# EAGLE design LEDFB (EAGLE 7.5.0)

## Sheet 1 of 4: MCU
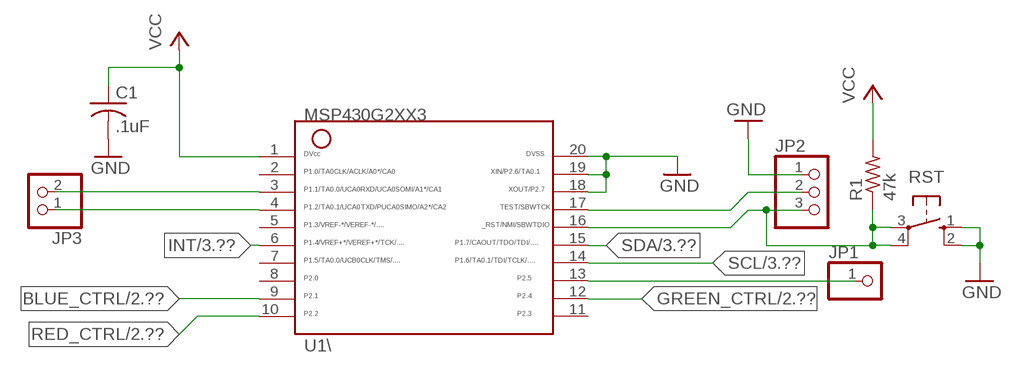
[diagram p0: schematic, sheet 1]

### Parts
C1  .1uF  C-USC0805  [C0805]
JP1  PINHD-1X1  [1X01]
JP2  PINHD-1X3  [1X03]
JP3  PINHD-1X2  [1X02]
R1  47k  R-US_R0805  [R0805]
RST  10-XX  [B3F-10XX]
U1\  G2XX3---PW20  [PW20]

### Nets
BLUE_CTRL: U1\.9 ; also sheet 2
GND: C1.2 JP2.1 RST.1(S) RST.2(S1) U1\.18 U1\.19 U1\.20 ; also sheet 2,3,4
GREEN_CTRL: U1\.12 ; also sheet 2
INT: U1\.6 ; also sheet 3
N$1: JP3.2 U1\.3
N$2: JP3.1 U1\.4
N$3: JP1.1 U1\.13
N$6: JP2.2 U1\.17
N$7: JP2.3 R1.1 RST.3(P) RST.4(P1) U1\.16
RED_CTRL: U1\.10 ; also sheet 2
SCL: U1\.14 ; also sheet 3
SDA: U1\.15 ; also sheet 3
VCC: C1.1 R1.2 U1\.1 ; also sheet 2,3,4
Unconnected: U1\.2 U1\.5 U1\.7 U1\.8 U1\.11

## Sheet 2 of 4: LED Drive
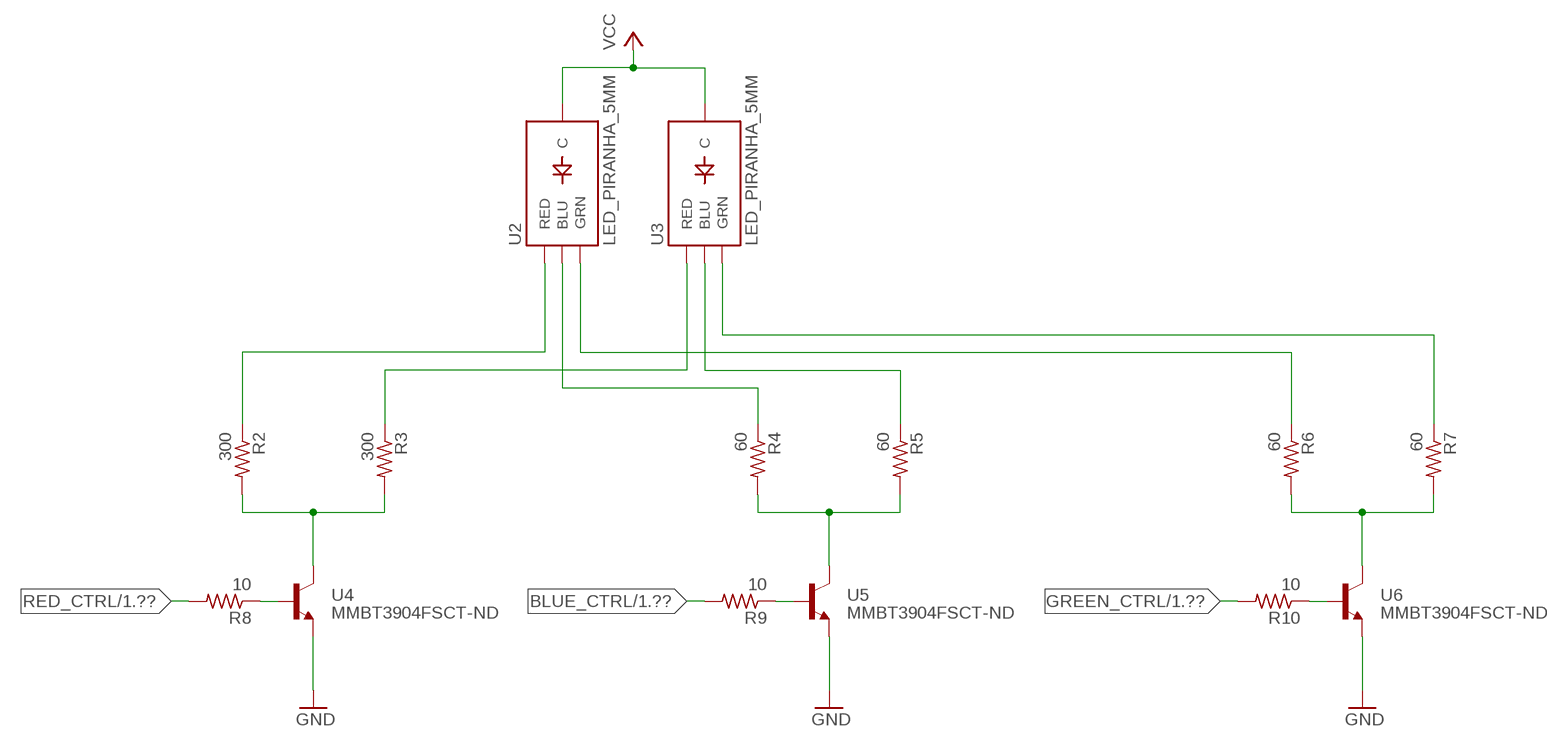
[diagram p1: schematic, sheet 2]

### Parts
R2  300  R-US_R0805  [R0805]
R3  300  R-US_R0805  [R0805]
R4  60  R-US_R0805  [R0805]
R5  60  R-US_R0805  [R0805]
R6  60  R-US_R0805  [R0805]
R7  60  R-US_R0805  [R0805]
R8  10  R-US_R0805  [R0805]
R9  10  R-US_R0805  [R0805]
R10  10  R-US_R0805  [R0805]
U2  LED_PIRANHA_5MM  [LED_PIRANHA_5MM]
U3  LED_PIRANHA_5MM  [LED_PIRANHA_5MM]
U4  MMBT3904FSCT-ND  [SOT-23]
U5  MMBT3904FSCT-ND  [SOT-23]
U6  MMBT3904FSCT-ND  [SOT-23]

### Nets
BLUE_CTRL: R9.2 ; also sheet 1
GND: U4.2(E) U5.2(E) U6.2(E) ; also sheet 1,3,4
GREEN_CTRL: R10.2 ; also sheet 1
N$4: R2.1 U2.R(RED)
N$5: R3.1 U3.R(RED)
N$8: R2.2 R3.2 U4.3(C)
N$9: R4.1 U2.B(BLU)
N$12: R8.1 U4.1(B)
N$13: R9.1 U5.1(B)
N$14: R10.1 U6.1(B)
N$15: R5.1 U3.B(BLU)
N$16: R4.2 R5.2 U5.3(C)
N$17: R6.2 R7.2 U6.3(C)
N$18: R6.1 U2.G(GRN)
N$19: R7.1 U3.G(GRN)
RED_CTRL: R8.2 ; also sheet 1
VCC: U2.C U3.C ; also sheet 1,3,4

## Sheet 3 of 4: Gyro
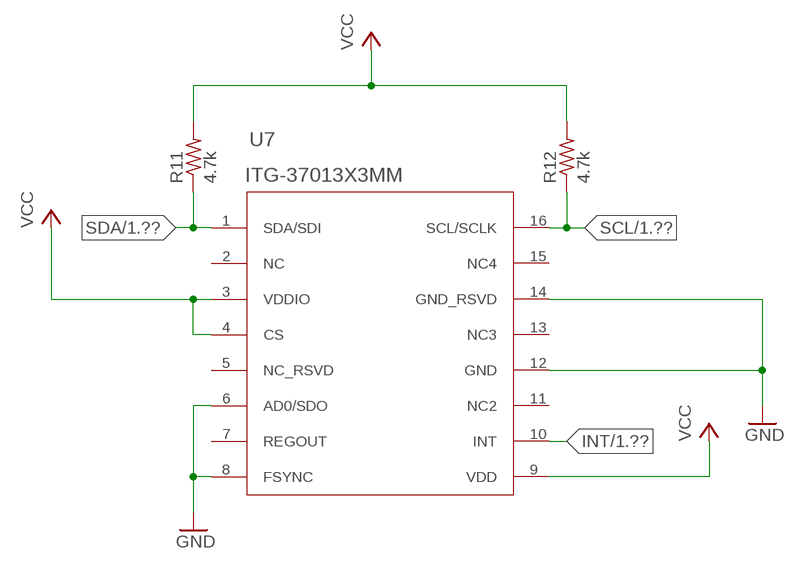
[diagram p2: schematic, sheet 3]

### Parts
R11  4.7k  R-US_M0805  [M0805]
R12  4.7k  R-US_M0805  [M0805]
U7  ITG-37013X3MM  [QFN-16]

### Nets
GND: U7.6(AD0/SDO) U7.8(FSYNC) U7.12(GND) U7.14(GND_RSVD) ; also sheet 1,2,4
INT: U7.10(INT) ; also sheet 1
SCL: R12.1 U7.16(SCL/SCLK) ; also sheet 1
SDA: R11.1 U7.1(SDA/SDI) ; also sheet 1
VCC: R11.2 R12.2 U7.3(VDDIO) U7.4(CS) U7.9(VDD) ; also sheet 1,2,4
Unconnected: U7.2(NC) U7.7(REGOUT) U7.11(NC2)

## Sheet 4 of 4: Power
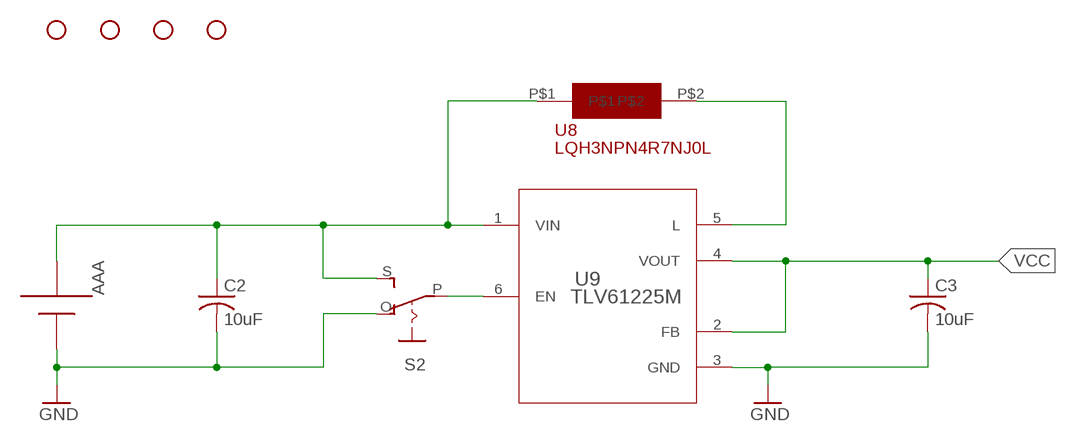
[diagram p3: schematic, sheet 4]

### Parts
AAA  AAA  [12BH412]
C2  10uF  C-USC0805  [C0805]
C3  10uF  C-USC0805  [C0805]
H1  STAND-OFF  [STAND-OFF]
H2  STAND-OFF  [STAND-OFF]
H3  STAND-OFF  [STAND-OFF]
H4  STAND-OFF  [STAND-OFF]
S2  EG1218S  [EG1218]
U8  LQH3NPN4R7NJ0  [1212]
U9  TLV61225M  [DCK0006A_M]

### Nets
GND: AAA.- C2.2 C3.2 S2.O U9.3(GND) ; also sheet 1,2,3
N$20: AAA.+ C2.1 S2.S U8.P$1 U9.1(VIN)
N$21: S2.P U9.6(EN)
N$22: U8.P$2 U9.5(L)
VCC: C3.1 U9.2(FB) U9.4(VOUT) ; also sheet 1,2,3

## Power pins joined to a net without a drawn wire
NC3: U7.13(NC3)
NC4: U7.15(NC4)
NC_RSVD: U7.5(NC_RSVD)

## Library data of the parts
AAA = adafruit:AAA: AAA PC pin holder Mouser part #12BH412 - but pretty much any 1x AAA battery holder should be the same http://www.ladyada.net/library/pcb/eaglelibrary.html
C1-C3 = adafruit:C-US: CAPACITOR, American symbol
H1-H4 = SparkFun-Electromechanical:STAND-OFF: #4 Stand Off This is the mechanical footprint for a #4 phillips button head screw. Use the keepout ring to avoid running the screw head into surrounding components. SKU : PRT-00447
JP1 = pinhead:PINHD-1X1: PIN HEADER
JP2 = pinhead:PINHD-1X3: PIN HEADER
JP3 = pinhead:PINHD-1X2: PIN HEADER
R1-R12 = adafruit:R-US_: RESISTOR, American symbol
RST = switch-omron:10-XX: OMRON SWITCH; MPN: B3F-1000; OC_FARNELL: 176432; OC_NEWARK: 36M3542
S2 = adafruit:EG1218: SLIDING SWITCH 0.1" spacing through hole, vertical SPDT slide switch http://www.ladyada.net/library/pcb/eaglelibrary.html
U1\ = TI_MSP430_v16:G2XX3---PW20: MSP430G2XX1 TSSOP (PW) 20 Pin Package
U2 U3 = SparkFun-LED:LED_PIRANHA_5MM: High-brightness RGB through-hole LED, similar to that used in the Shiftbrite
U4-U6 = GuShH:MMBT3904
U7 = itg_3701:ITG-3701: ITG-3701 Gyroscope by Invensense.
U8 = inductor:LQH3NPN4R7NJ0: 4.7uH 3x3mm Inductor
U9 = TLV61225:TLV61225: TLV61225 part by Texas Instruments. Link to datasheet: http://www.ti.com/lit/ds/symlink/tlv61225.pdf

## Board
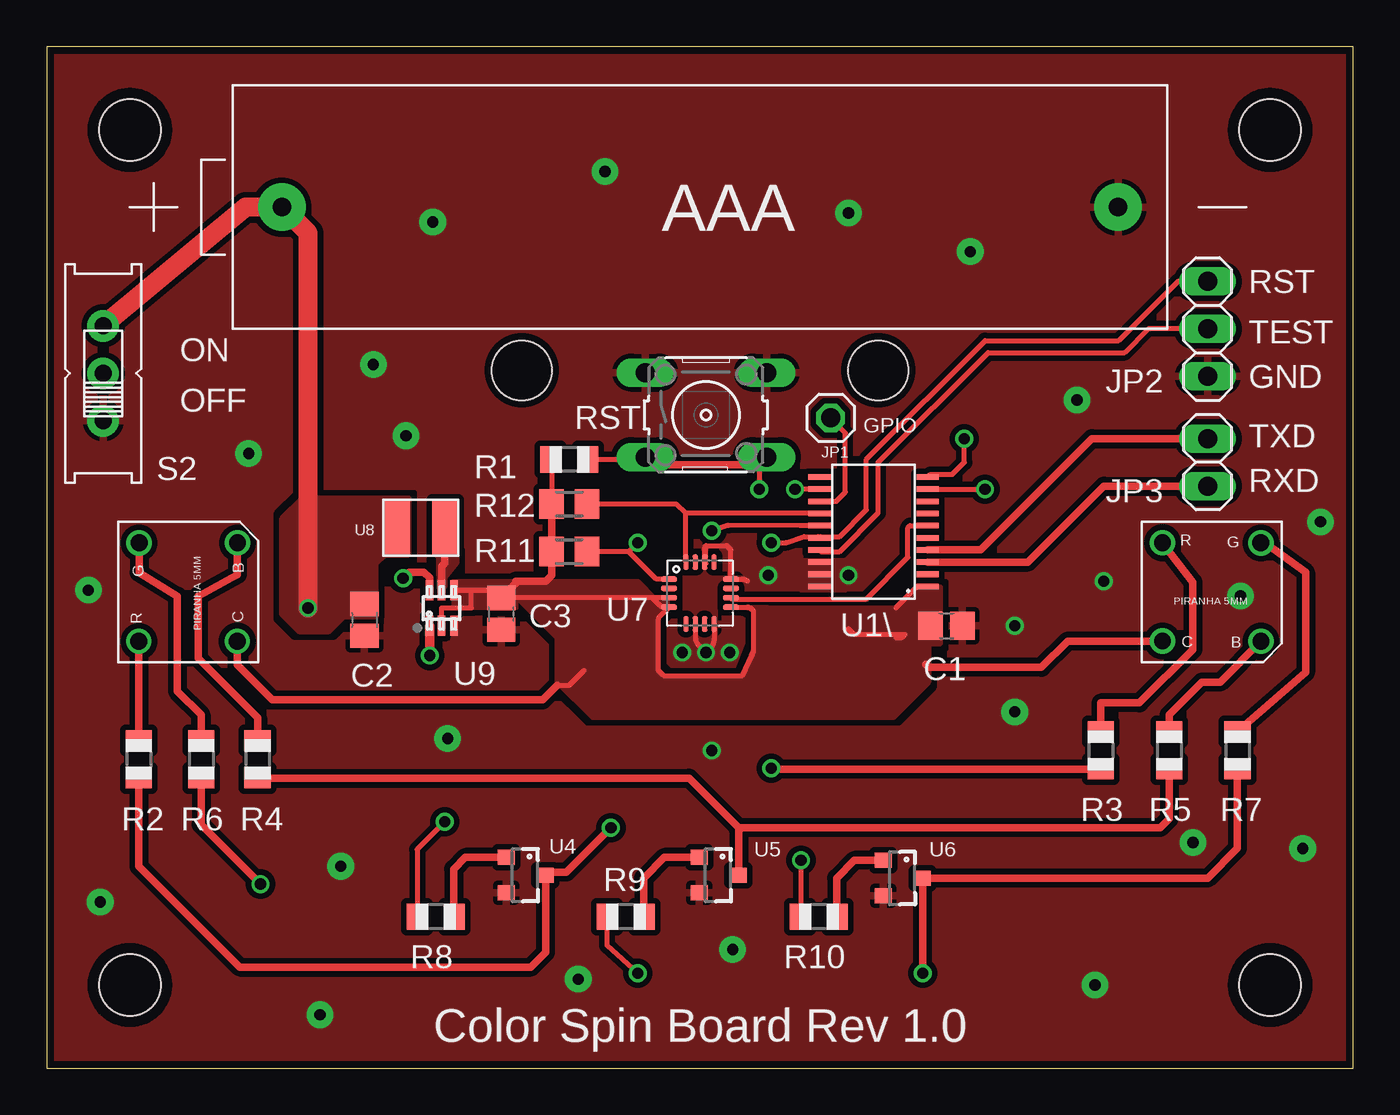
[diagram p4: board, top side]
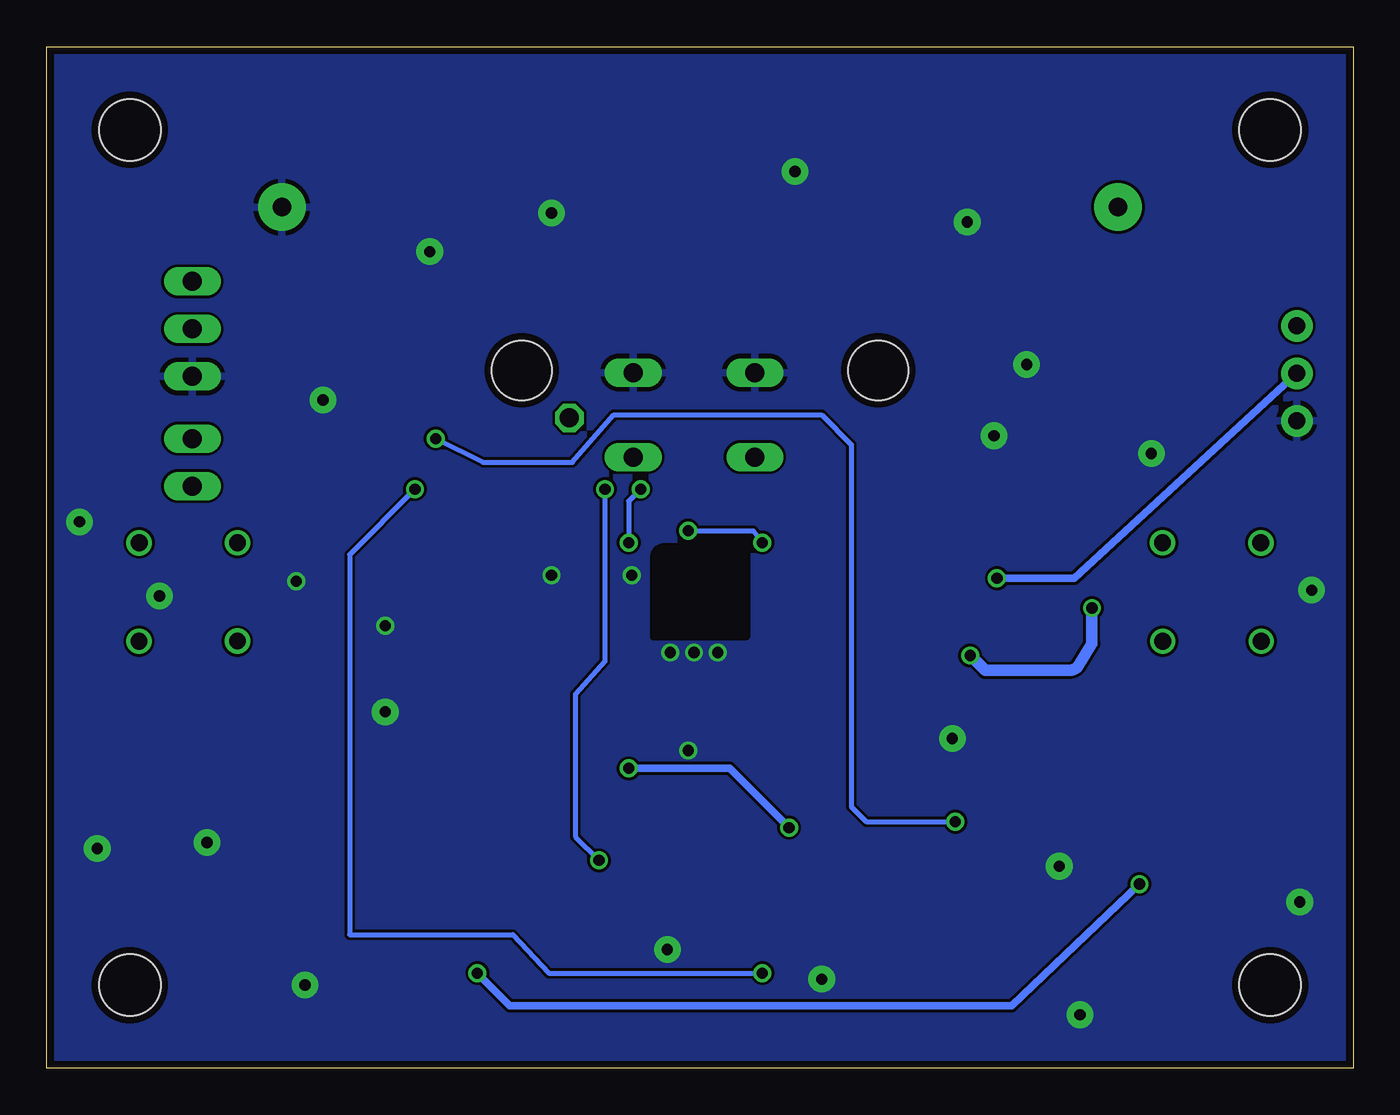
[diagram p5: board, bottom side, seen from below]

Size 69.85 x 54.61 mm. Coordinates in mm from the lower left corner, seen from the top.
Outline: 0,0 69.85,0 69.85,54.61 0,54.61 0,0
Copper layers (1*16): Top 0.0356mm / dielectric 1.5011mm / Bottom 0.0356mm
Design rules "oshpark-2layer": minimum track width 6mil, minimum drill 13mil, track to track 6mil, track to pad 6mil, pad to pad 6mil, via to via 6mil, smd to smd 6mil, copper to edge 15mil, drill to drill 6mil, minimum pad ring 7mil, minimum via ring 7mil, stop-mask expansion 2.5mil, vias tented up to drill 0mil, thermal gap 10mil
Holes 3.2 mm at 25.4,37.31 44.45,37.31

### Footprints (pad centres in the part's own frame; a part is rotated, then mirrored left to right if it is on the bottom)
12BH412 = drill 1 pad 2.54: + 22.352,0; - -22.352,0
C0805 = smd 1.3 x 1.5: 1 -0.85,0; 2 0.85,0
STAND-OFF = hole 3.302: 0,0
1X01 = drill 1.016 octagon: 1 0,0
1X03 = drill 1.016 long: 1 -2.54,0; 2 0,0; 3 2.54,0
1X02 = drill 1.016 long: 1 -1.27,0; 2 1.27,0
R0805 = smd 1.1 x 1.4: 1 -1,0; 2 1,0
M0805 = smd 1.3 x 1.6: 1 -0.95,0; 2 0.95,0
B3F-10XX = drill 1.016 long: 1 -3.251,2.261; 2 3.251,2.261; 3 -3.251,-2.261; 4 3.251,-2.261
EG1218 = drill 0.9 pad 1.676: O -2.54,0; P 0,0; S 2.54,0
PW20 = smd 0.3 x 1.2: 1 -2.925,-2.9; 2 -2.275,-2.9; 3 -1.625,-2.9; 4 -0.975,-2.9; 5 -0.325,-2.9; 6 0.325,-2.9; 7 0.975,-2.9; 8 1.625,-2.9; 9 2.275,-2.9; 10 2.925,-2.9; 11 2.925,2.9; 12 2.275,2.9; 13 1.625,2.9; 14 0.975,2.9; 15 0.325,2.9; 16 -0.325,2.9; 17 -0.975,2.9; 18 -1.625,2.9; 19 -2.275,2.9; 20 -2.925,2.9
LED_PIRANHA_5MM = drill 0.9: B -2.688,2.574; C 2.575,2.562; G -2.684,-2.684; R 2.579,-2.696
SOT-23 = smd 0.8 x 0.9: 1 -0.95,-1; 2 0.95,-1; 3 0,1.1
QFN-16 = smd 0.85 x 0.3: 1 -1.655,0.75; 2 -1.655,0.25; 3 -1.655,-0.25; 4 -1.655,-0.75; 9 1.655,-0.75; 10 1.655,-0.25; 11 1.655,0.25; 12 1.655,0.75 | smd 0.3 x 0.85: 5 -0.75,-1.655; 6 -0.25,-1.655; 7 0.25,-1.655; 8 0.75,-1.655; 13 0.75,1.655; 14 0.25,1.655; 15 -0.25,1.655; 16 -0.75,1.655
1212 = smd 3 x 1.4: P$1 0,1.3; P$2 0,-1.3
DCK0006A_M = smd 1.05 x 0.4: 1 -0.95,0.65; 2 -0.95,0; 3 -0.95,-0.65; 4 0.95,-0.65; 5 0.95,0; 6 0.95,0.65

### Placement (x,y rotation side)
AAA  34.92,46.04 180 top
C1  48.1,23.65 0 top
C2  16.99,23.97 270 top
C3  24.29,24.29 270 top
H1  4.45,4.45 0 top
H2  65.41,4.45 0 top
H3  4.45,50.16 0 top
H4  65.41,50.16 0 top
JP1  41.91,34.77 0 top
JP2  62.07,39.53 90 top
JP3  62.07,32.38 270 top
R1  27.94,32.54 180 top
R2  4.92,16.51 270 top
R3  56.36,16.99 270 top
R4  11.27,16.51 270 top
R5  60.01,16.99 270 top
R6  8.26,16.51 270 top
R7  63.66,16.99 270 top
R8  20.8,8.1 180 top
R9  30.96,8.1 180 top
R10  41.27,8.1 180 top
R11  27.94,27.62 180 top
R12  27.94,30.16 180 top
RST  35.24,34.92 0 top
S2  3.02,37.15 90 top
U1\  44.2,28.68 90 top
U2  7.62,25.4 270 top
U3  62.23,25.4 180 top
U4  25.56,10.32 270 top
U5  35.88,10.32 270 top
U6  45.72,10.16 270 top
U7  34.92,25.4 0 top
U8  20,28.89 90 top
U9  21.11,24.61 90 top

### Tracks (layer width: path | path; a pad name or v marks a point on that pad's centre or on a via)
BLUE_CTRL  (via drill 0.6)
  Top 0.254: U1\.9 v50.16,30.96 | v31.59,5.08 29.96,6.56 R9.2
  Bottom 0.254: v50.16,30.96 53.66,27.46 53.66,7.14 44.93,7.14 43.02,5.08 v31.59,5.08
GND  (via drill 0.6, 0.6 pad 1.42)
  Top 0.254: U7.6 34.67,23.06 arc45 34.86,22.61 v35.24,22.23 35.49,22.47 arc45 35.67,22.92 U7.8 | 37.47,26.04 arc45 37.19,26.15 U7.12 36.58,27.71 36.35,27.94 35.24,27.94 | 35.24,27.94 arc45 35.17,27.78 U7.14 35.24,26.99 35.24,27.94
  Bottom 0.254: v35.24,22.23 35.24,22.54
  other vias: 33.97,22.23 36.51,22.23 38.58,26.35 42.86,26.35 20.64,45.24 42.86,45.72 49.37,43.66 17.46,37.62 19.21,33.81 2.86,8.89 14.61,2.86 56.04,4.45 67.15,11.75 21.43,17.62 15.72,10.79 29.84,47.94 10.79,32.86 2.22,25.56 51.75,19.05 55.09,35.72 68.1,29.21 63.82,25.24 28.42,4.76 61.28,12.06 36.67,6.35 35.56,16.99 51.75,23.65 56.52,26.04
  pour Top (isolate 0.305, rank 2): 0.16,54.61 69.85,54.61 69.85,0 0,0
  pour Top (no thermals): 21.75,23.97 22.38,23.97 22.38,22.7 21.75,22.7
  pour Top: 42.39,25.88 42.39,25.72 40.16,25.72
  pour Top (no thermals): 40.32,27.15 42.7,27.15 42.7,26.67 42.7,25.56 40.32,25.56
  pour Bottom: 0,54.61 69.85,54.61 69.85,0 0,0
GREEN_CTRL  (via drill 0.6)
  Top 0.254: U1\.12 40.8,30.96 v40.01,30.96 | v40.32,11.11 40.32,8.14
  Top 0.406: 40.32,8.14 R10.2
  Bottom 0.254: v40.01,30.96 40.01,21.75 41.59,20 41.59,12.38 v40.32,11.11
INT
  Top 0.254: U7.10 36.65,25.08 43.81,25.08 46.04,27.3 46.04,28.89 46.15,29.01 U1\.6
N$1
  Top 0.406: U1\.3 52.46,27.06 56.52,31.11 JP3.2
N$2
  Top 0.406: U1\.4 49.93,27.71 55.88,33.66 JP3.1
N$3
  Top 0.254: U1\.13 42.21,30.31 42.7,30.8 42.7,33.97 JP1.1
N$4
  Top 0.406: U2.R R2.1
N$5
  Top 0.406: R3.1 56.36,19.53 58.42,19.53 61.28,22.38 61.28,25.99 U3.R
N$6
  Top 0.254: U1\.17 41.39,27.62 42.39,27.62 44.45,29.69 44.45,32.38 50.32,38.26 57.63,38.26 58.9,39.53 JP2.2
N$7  (via drill 0.6)
  Top 0.254: R1.1 31.87,32.54 RST.3 | RST.4 38.1,32.27 v38.1,30.96 | v38.73,28.1 39.53,28.1 40.48,28.42 41.24,28.42 U1\.16 41.36,28.42 42.39,28.42 43.81,29.84 43.81,32.54 50.16,38.89 57.31,38.89 60.48,42.07 JP2.3
  Top 0.406: 38.1,32.27 32.38,32.27 RST.3
  Bottom 0.254: v38.1,30.96 38.73,30.32 v38.73,28.1
N$8  (via drill 0.6)
  Top 0.406: U4.3 | R3.2 38.78,15.99 v38.73,16.03 | v30.16,12.86 27.78,10.48 26.82,10.48 U4.3 | R2.2 4.92,10.79 10.32,5.4 25.88,5.4 26.67,6.19 26.67,10.31 U4.3
  Bottom 0.406: v38.73,16.03 33.34,16.03 v30.16,12.86
N$9
  Top 0.406: U2.B 10.19,26.39 8.1,25.24 8.1,21.91 11.27,18.73 R4.1 11.64,17.78 11.27,17.62
N$10
  cutout Bottom (no thermals): 32.38,27.94 36.83,27.94 arc-90 37.47,27.3 37.47,23.18 arc-90 37.47,23.17 37.47,23.03 32.45,23.03 arc-90 32.36,23.13 32.36,27.93 32.37,27.93 arc90
N$12
  Top 0.406: U4.1 22.38,11.27 21.75,10.64 21.75,8.14 R8.1
N$13
  Top 0.406: 32.23,8.37 R9.1 31.91,8.14 31.91,10.16 33.02,11.27 U5.1
N$14
  Top 0.406: U6.1 43.18,11.11 42.23,10.16 42.23,8.14 R10.1
N$15
  Top 0.406: U3.B 62.73,20.64 61.75,20.64 60.01,18.89 R5.1
N$16
  Top 0.406: R4.2 34.34,15.51 36.99,12.86 36.99,12.7 | 36.99,12.7 U5.3 | R5.2 60.01,13.34 59.53,12.86 37.15,12.86 36.99,12.7
N$17  (via drill 0.6)
  Top 0.406: R7.2 63.66,11.75 62.07,10.16 U6.3 46.83,10.15 v46.83,5.08 | R6.2 8.26,13.02 v11.43,9.84
  Bottom 0.406: v11.43,9.84 18.26,3.33 45.09,3.33 v46.83,5.08
N$18
  Top 0.406: U2.G 4.94,26.5 6.99,25.24 6.99,20.16 8.26,18.89 R6.1
N$19
  Top 0.406: U3.G 65.58,27.77 67.31,26.51 67.31,21.16 R7.1
N$20  (via drill 0.6)
  Top 0.254: 20.46,22.1 arc45 v20.48,22.07
  Top 0.508: U9.1 20.46,22.1
  Top 1.016: S2.S 10.64,46.04 AAA.+ 13.97,44.64 v13.97,24.61
  Bottom 0.61: v20.48,22.07 19.68,21.27 15.19,21.27 arc-45 14.74,21.46 13.97,22.7 v13.97,24.61
  pour Top (no thermals): 17.09,24.61 arc-45 16.91,24.68 16.51,25.08
  pour Top (no thermals): 19.37,30.48 13.65,30.48 12.54,29.37 12.54,24.29 13.49,23.34 15.08,23.34 15.88,24.13 17.62,24.13 17.62,26.99 18.1,27.46 19.37,27.46
N$21  (via drill 0.6)
  Top 0.406: U9.6 20.46,26.21 20.16,26.51 19.37,26.51 v19.05,26.19
  Bottom 0.406: v19.05,26.19 14.92,26.19 S2.P
N$22
  Top 0.406: U9.5 21.11,26.83 21.27,26.99 21.27,27.97 U8.P$2
  pour Top (no thermals): 20.95,25.72 20.95,27.3 20.8,27.46 21.91,27.46 21.91,26.99 21.27,26.19 21.27,25.72
RED_CTRL  (via drill 0.6)
  Top 0.254: U1\.10 47.25,31.75 48.42,31.75 49.05,32.38 v49.05,33.66 | v21.27,13.18 19.8,11.7 R8.2
  Bottom 0.254: v49.05,33.66 46.51,32.38 41.75,32.38 39.53,34.92 28.42,34.92 26.83,33.34 26.83,13.97 26.04,13.18 v21.27,13.18
SCL
  Top 0.254: U7.16 34.17,29.64 34.16,29.66 | 34.16,29.66 33.66,30.16 R12.1 | U1\.14 34.16,29.66
SDA  (via drill 0.6)
  Top 0.254: U7.1 32.59,26.15 31.11,27.62 | 31.11,27.62 R11.1 | U1\.15 40.28,29.01 36.45,29.02 v35.56,28.73 | v31.59,28.1 31.11,27.62
  Bottom 0.254: v35.56,28.73 32.07,28.73 v31.59,28.1
VCC
  Top 0.254: U9.2 21.11,24.61 22.7,24.61 22.7,25.56 | U7.3 32.38,25.15 | 32.38,25.15 24.32,25.15 arc45 C3.1 | 32.38,25.15 32.81,24.72 arc45 32.99,24.65 U7.4 32.78,24.16 arc45 32.7,23.98 32.7,21.27 32.95,21.03 arc45 33.12,20.95 37.15,20.95 37.71,22.15 arc45 37.78,22.33 37.78,24.45 37.65,24.58 arc45 37.48,24.65 U7.9 | 45.4,23.02 45.72,23.02 45.88,23.18 43.18,23.18 42.86,23.5 | R1.2 26.99,32.65 R12.2 | 27.3,20.48 27.94,20.48 28.73,21.27 | U1\.1 46.55,25.76 45.4,24.61
  Top 0.305: U9.4 22.7,25.56 24.29,25.56 C3.1
  Top 0.406: R12.2 R11.2 26.99,26.36 26.67,26.04 25.08,26.04 25.08,25.93 C3.1 | U2.C 10.18,21.57 12.06,19.68 26.51,19.68 27.3,20.48 | U3.C 54.59,22.84 53.18,21.43 47.15,21.43 46.99,21.59
  pour Top (no thermals): 21.75,26.04 25.08,26.04 25.08,24.61 22.49,24.61 arc-45 22.31,24.68 21.75,25.24
  pour Top (no thermals): 25.24,26.04 31.59,26.04 32.54,25.08 33.18,25.08 33.18,24.61 32.7,24.13 32.7,21.27 33.02,20.95 36.99,20.95 38.1,20.95 41.12,23.97 47.15,23.97 47.15,20.64 45.24,18.73 29.21,18.73 27.3,20.64 27.3,23.02 25.24,25.08
  pour Top (no thermals): 37.15,20.8 38.42,20.8 41.27,23.65 41.27,24.29 39.05,24.29 38.58,24.61 37.47,24.61 37.78,24.45 37.78,22.38
  pour Top (no thermals): 38.58,24.61 45.4,24.61 45.4,23.18 44.13,21.91 41.27,21.91
  pour Top (no thermals): 46.51,25.72 45.4,24.61 45.4,22.7 47.78,22.7 47.78,25.72
  pour Top (no thermals): 21.75,25.24 21.75,24.61 22.54,24.61 22.54,25.24

### Text on the board
tPlace: RST | TEST | ON | GND | OFF | GPIO | TXD | RXD | Color Spin Board Rev 1.0